# EAGLE schematic Qwiic-RTC (EAGLE 7.7.0)
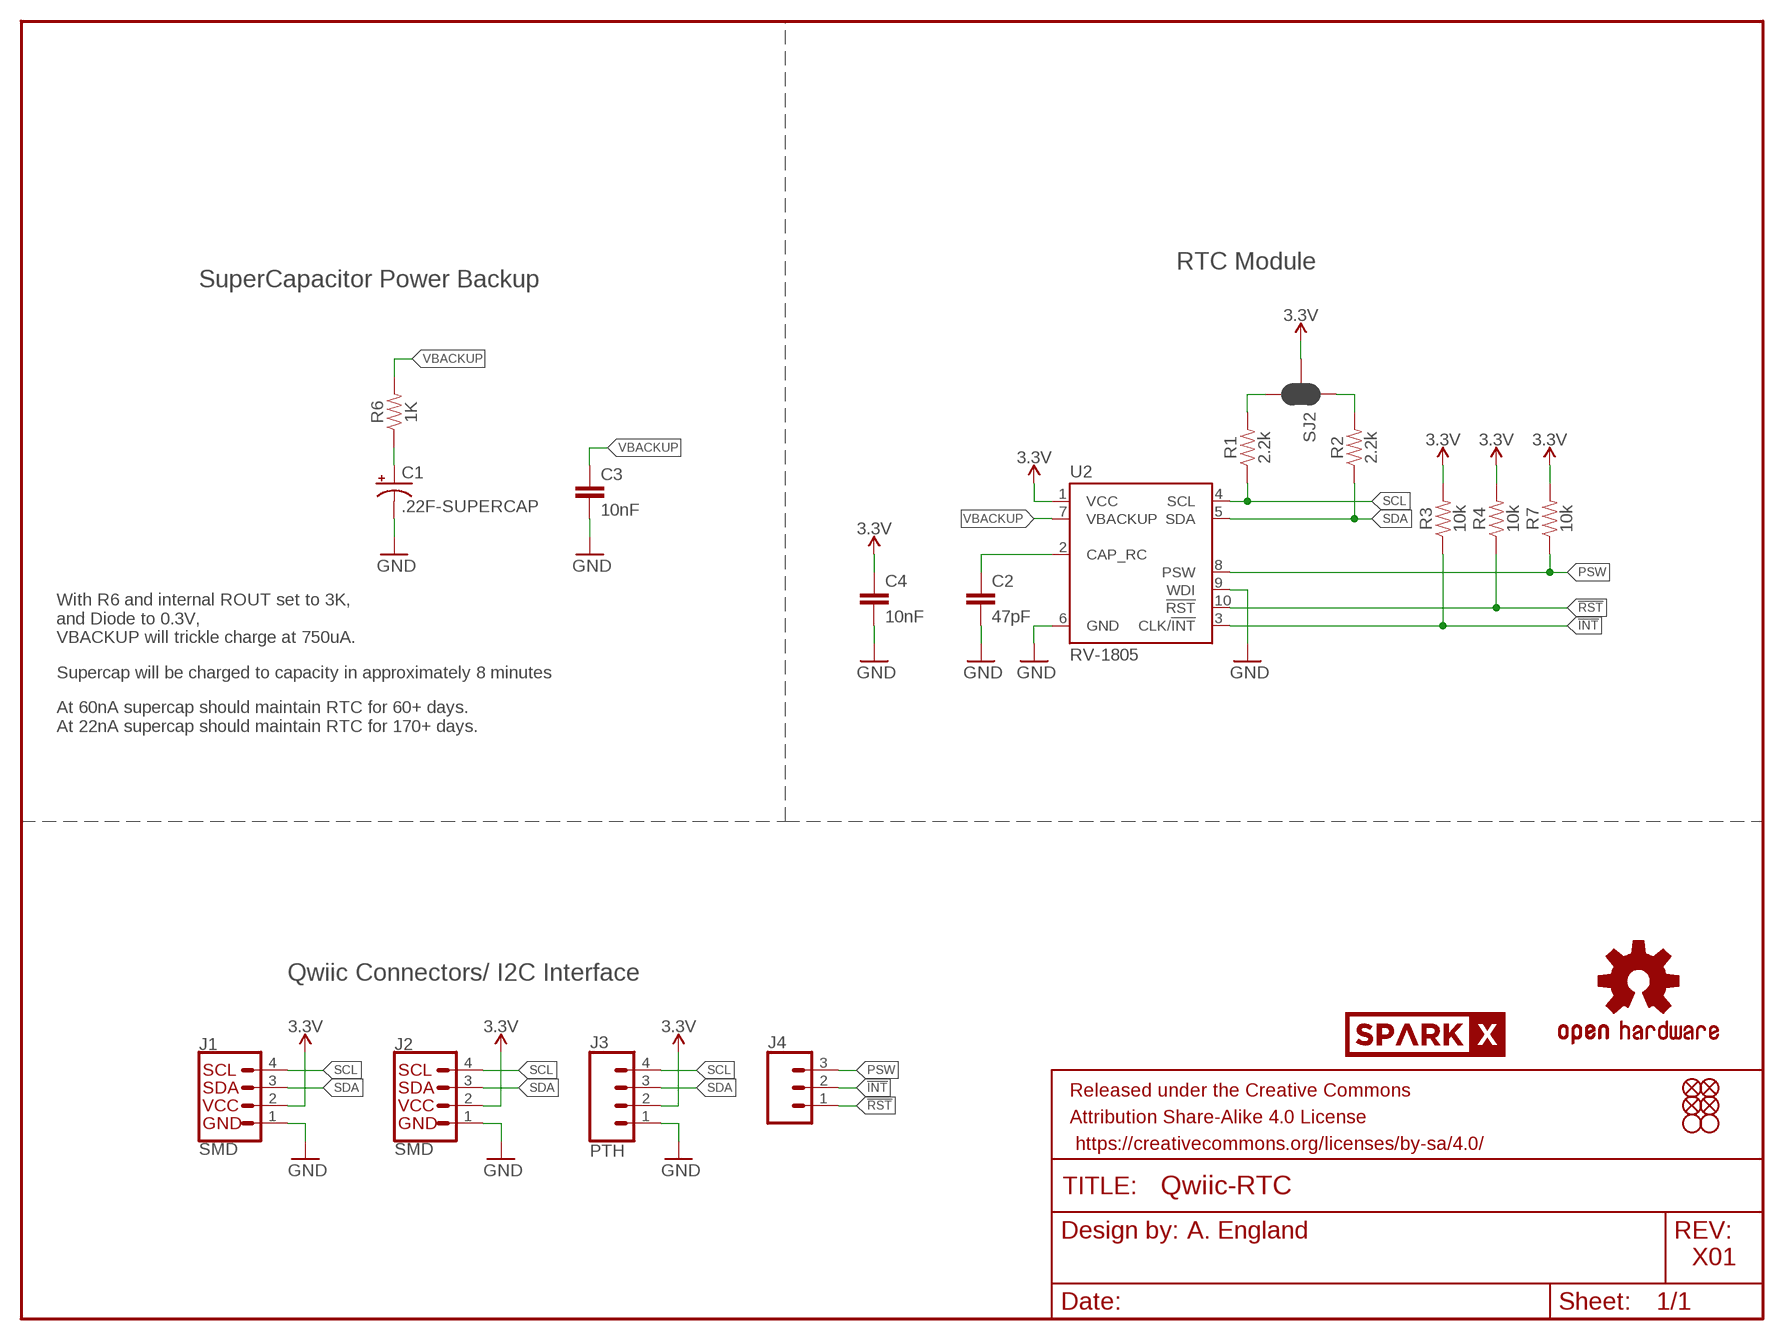
[diagram p0: schematic, sheet 1]

## Parts
C1  .22F-SUPERCAP  [DSK-RADIAL-6.8MM]
C2  47pF  47PF-0603-50V-5%  [0603]
C3  10nF  10NF-0603-50V-10%  [0603]
C4  10nF  10NF-0603-50V-10%  [0603]
FD1  FIDUCIALUFIDUCIAL  [FIDUCIAL-MICRO]
FD2  FIDUCIALUFIDUCIAL  [FIDUCIAL-MICRO]
FD3  FIDUCIALUFIDUCIAL  [FIDUCIAL-MICRO]
FD4  FIDUCIALUFIDUCIAL  [FIDUCIAL-MICRO]
FRAME2  FRAME-LETTER  [CREATIVE_COMMONS]
J1  SMD  QWIIC_CONNECTORJS-1MM  [1X04_1MM_RA]
J2  SMD  QWIIC_CONNECTORJS-1MM  [1X04_1MM_RA]
J3  PTH  CONN_041X04_NO_SILK  [1X04_NO_SILK]
J4  CONN_031X03_NO_SILK  [1X03_NO_SILK]
LOGO1  OSHW-LOGOS  [OSHW-LOGO-S]
R1  2.2k  2.2KOHM-0603-1/10W-1%  [0603]
R2  2.2k  2.2KOHM-0603-1/10W-1%  [0603]
R3  10k  10KOHM-0603-1/10W-1%  [0603]
R4  10k  10KOHM-0603-1/10W-1%  [0603]
R6  1K  2.55KOHM-0603-1/10W-1%  [0603]
R7  10k  10KOHM-0603-1/10W-1%  [0603]
SJ2  JUMPER-SMT_3_2-NC_PASTE_SILK  [SMT-JUMPER_3_2-NC_PASTE_SILK]
U2  RV-1805  [RV-1805]
U$3  SPARKX-LOGO4  [SPARKX-MEDIUM]
U$5  SPARKX-LOGO4  [SPARKX-MEDIUM]
U$6  STAND-OFF  [STAND-OFF]
U$7  STAND-OFF  [STAND-OFF]

## Nets
3.3V: C4.1 J1.2 J2.2 J3.2 R3.2 R4.2 R7.2 SJ2.2 U2.1(VCC)
!INT: J4.2 R3.1 U2.3(CLK/!INT)
!RST: J4.1 R4.1 U2.10(!RST)
GND: C1.- C2.2 C3.2 C4.2 J1.1 J2.1 J3.1 U2.6(GND) U2.9(WDI)
N$1: R1.2 SJ2.3
N$2: R2.2 SJ2.1
N$4: C2.1 U2.2(CAP_RC)
N$5: C1.+ R6.1
PSW: J4.3 R7.1 U2.8(PSW)
SCL: J1.4 J2.4 J3.4 R1.1 U2.4(SCL)
SDA: J1.3 J2.3 J3.3 R2.1 U2.5(SDA)
VBACKUP: C3.1 R6.2 U2.7(VBACKUP)

## Notes on the sheet
- RTC Module
- SuperCapacitor Power Backup
- With R6 and internal ROUT set to 3K,
  and Diode to 0.3V, 
  VBACKUP will trickle charge at 750uA.
- Supercap will be charged to capacity in approximately 8 minutes
- At 60nA supercap should maintain RTC for 60+ days.
  At 22nA supercap should maintain RTC for 170+ days.
- Qwiic Connectors/ I2C Interface
- A. England
- X01

## Library data of the parts
C1 = SparkFun-Capacitors:.22F-SUPERCAP: ELNA DSK-621 - 220mF Electric Double Layer Capacitor (EDLC/SuperCapacitor) A 220 mF SuperCapacitor. Used for backup power on devices with low standby current; PROD_ID: CAP-13907
C2 = SparkFun-Capacitors:47PF: 47pF ceramic capacitors A capacitor is a passive two-terminal electrical component used to store electrical energy temporarily in an electric field.; PROD_ID: CAP-08913
C3 C4 = SparkFun-Capacitors:10NF: 0.01uF/10nF/10,000pF ceramic capacitors A capacitor is a passive two-terminal electrical component used to store electrical energy temporarily in an electric field. CAP-09321; PROD_ID: CAP-00867
FD1-FD4 = SparkFun-Aesthetics:FIDUCIAL: Fiducial Alignment Points Point-of-reference for pick-and-place machines and other optical instruments.
FRAME2 = SparkFun-Aesthetics:FRAME-LETTER: Schematic Frame - Letter Standard 8.5x11 US Letter frame
J1 J2 = SparkFun-Connectors:QWIIC_CONNECTOR: SparkFun I2C Standard Qwiic Connector An SMD 1mm pitch JST connector makes it easy and quick (get it? Qwiic?) to connect I2C devices to each other. The Qwiic system <http://www.sparkfun.com/qwiic> enables fast and solderless connection between popular platforms and various sensors and actuators. We carry 200mm <https://www.sparkfun.com/products/14204>, 100mm <https://www.sparkfun.com/products/14205>, 50mm <https://www.sparkfun.com/products/14206>, and breadboard friendly <https://www.sparkfun.com/products/14207> Qwiic cables. We also offer 10 pcs strips <https://www.sparkfun.com/products/14323> the SMD connectors.; PROD_ID: CONN-13694
J3 = SparkFun-Connectors:CONN_04: Multi connection point. Often used as Generic Header-pin footprint for 0.1 inch spaced/style header connections On any of the 0.1 inch spaced packages, you can populate with these: Break Away Headers - Straight <https://www.sparkfun.com/products/116> (PRT-00116) Break Away Male Headers - Right Angle <https://www.sparkfun.com/products/553> (PRT-00553) Female Headers <https://www.sparkfun.com/products/115> (PRT-00115) Break Away Headers - Machine Pin <https://www.sparkfun.com/products/117> (PRT-00117) Break Away Female Headers - Swiss Machine Pin <https://www.sparkfun.com/products/743> (PRT-00743) For SCREWTERMINALS and SPRING TERMINALS visit here: Screw Terimnals on SparkFun.com <https://www.sparkfun.com/search/results?term=Screw+Terminals> (5mm/3.5mm/2.54mm spacing) This device is also useful as a general connection point to wire up your design to another part of your project. Our various solder wires solder well into these plated through hole pads. Hook-Up Wire - Assortment (Stranded, 22 AWG) <https://www.sparkfun.com/products/11375> (PRT-11375) Hook-Up Wire - Assortment (Solid Core, 22 AWG) <https://www.sparkfun.com/products/11367> (PRT-11367) View the entire wire category on our website here <https://www.sparkfun.com/categories/141> Special notes: Molex polarized connector foot print use with SKU : PRT-08231 with associated crimp pins and housings. 1MM SMD Version SKU: PRT-10208; PROD_ID: CONN-09696
J4 = SparkFun-Connectors:CONN_03: Multi connection point. Often used as Generic Header-pin footprint for 0.1 inch spaced/style header connections On any of the 0.1 inch spaced packages, you can populate with these: Break Away Headers - Straight <https://www.sparkfun.com/products/116> (PRT-00116) Break Away Male Headers - Right Angle <https://www.sparkfun.com/products/553> (PRT-00553) Female Headers <https://www.sparkfun.com/products/115> (PRT-00115) Break Away Headers - Machine Pin <https://www.sparkfun.com/products/117> (PRT-00117) Break Away Female Headers - Swiss Machine Pin <https://www.sparkfun.com/products/743> (PRT-00743) Stackable Header - 3 Pin (Female, 0.1") <https://www.sparkfun.com/products/13875> (PRT-13875) For SCREWTERMINALS and SPRING TERMINALS visit here: Screw Terimnals on SparkFun.com <https://www.sparkfun.com/search/results?term=Screw+Terminals> (5mm/3.5mm/2.54mm spacing) This device is also useful as a general connection point to wire up your design to another part of your project. Our various solder wires solder well into these plated through hole pads. Hook-Up Wire - Assortment (Stranded, 22 AWG) <https://www.sparkfun.com/products/11375> (PRT-11375) Hook-Up Wire - Assortment (Solid Core, 22 AWG) <https://www.sparkfun.com/products/11367> (PRT-11367) View the entire wire category on our website here <https://www.sparkfun.com/categories/141> Special notes: Molex polarized connector foot print use with SKU : PRT-08232 with associated crimp pins and housings.
LOGO1 = SparkFun-Aesthetics:OSHW-LOGO: Open Source Hardware Logo This logo indicates the piece of hardware it is found on incorporates a OSHW license and/or adheres to the definition of open source hardware found here: http://freedomdefined.org/OSHW
R1 R2 = SparkFun-Resistors:2.2KOHM: 2.2kΩ resistor A resistor is a passive two-terminal electrical component that implements electrical resistance as a circuit element. Resistors act to reduce current flow, and, at the same time, act to lower voltage levels within circuits. - Wikipedia; PROD_ID: RES-08272
R3 R4 R7 = SparkFun-Resistors:10KOHM: 10kΩ resistor A resistor is a passive two-terminal electrical component that implements electrical resistance as a circuit element. Resistors act to reduce current flow, and, at the same time, act to lower voltage levels within circuits. - Wikipedia; PROD_ID: RES-00824
R6 = SparkFun-Resistors:2.55KOHM: 2.55kΩ resistor A resistor is a passive two-terminal electrical component that implements electrical resistance as a circuit element. Resistors act to reduce current flow, and, at the same time, act to lower voltage levels within circuits. - Wikipedia; PROD_ID: RES-11227; VALUE: 2.55k
SJ2 = SparkFun-Jumpers:JUMPER-SMT_3_2-NC_PASTE: Normally closed solder jumper (2 of 2 connections) This jumper has an aperture in the stencil to allow solder paste to bridge both connections. Both connections are normally closed (NC). Wick off the solder to open the connection(s). Reapply solder to reclose the connection(s).
U2 = SparkFun-Clocks:RV-1805: Micro Crystal Switzerland - RV-1805-C3 - Extremely low power RTC module This RTC IC has been specially designed for ultimate low current consumption of typically 60 nA @ VDD 3.0V for 32.768 kHz XTAL mode. Additionally, there is an RC-Mode consuming only 17nA and an autocalibrated RC-mode consuming 22nA which permits to operate this RTC module several hours at Backup Supply Voltage using low-cost MLCC. The very small SMT ceramic-package combines the 32.768 kHz crystal unit with the CMOS-based oscillator and real-time-clock IC.
U$3 U$5 = SparkX:SPARKX-LOGO
U$6 U$7 = SparkFun:STAND-OFF: Stand Off This is the mechanical footprint for a #4 phillips button head screw. Use the keepout ring to avoid running the screw head into surrounding components. SKU : PRT-00447